# EAGLE design RH019.1 (EAGLE 7.1.0)
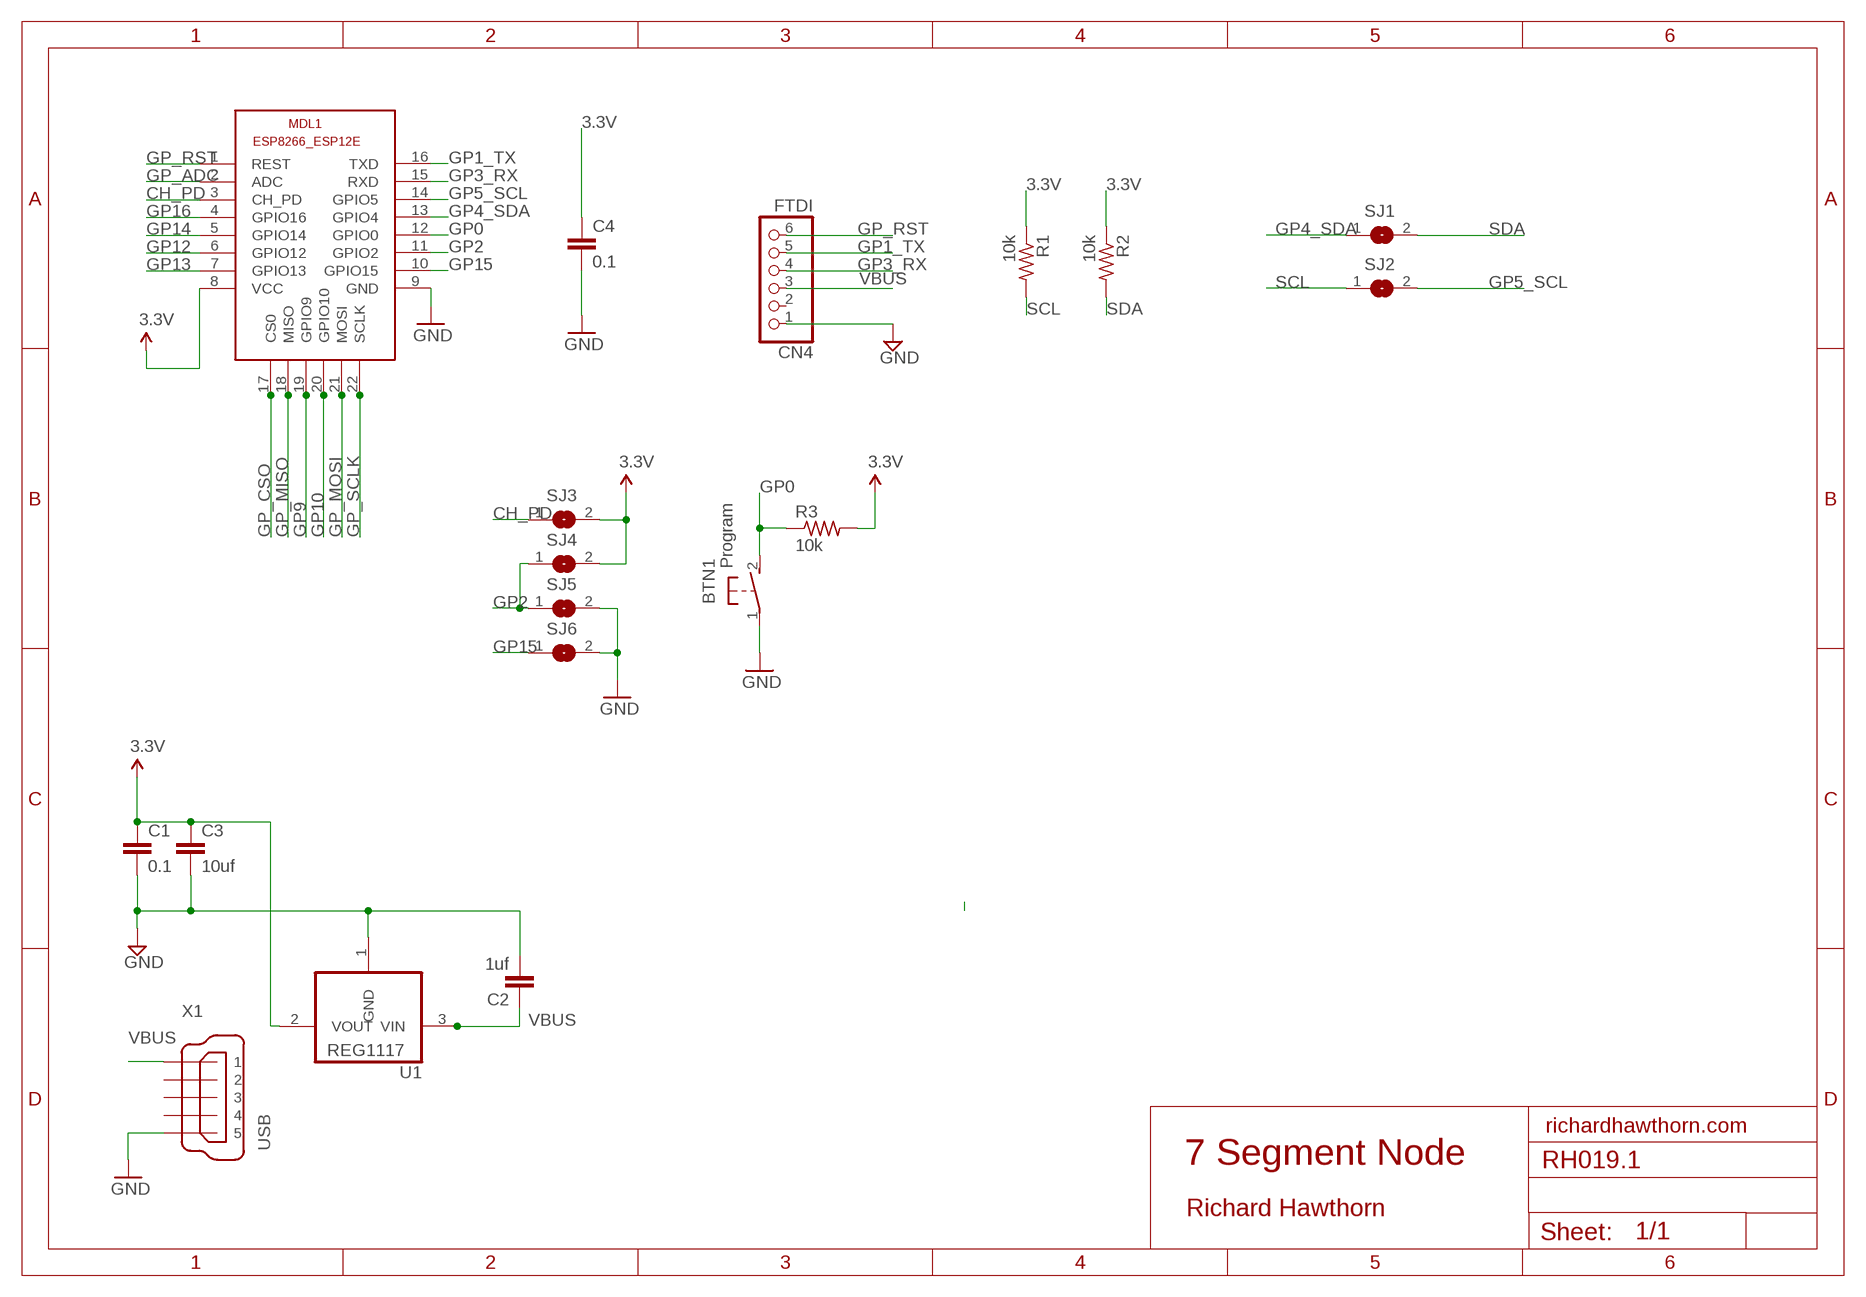
[diagram p0: schematic, sheet 1, part 1 of 2]
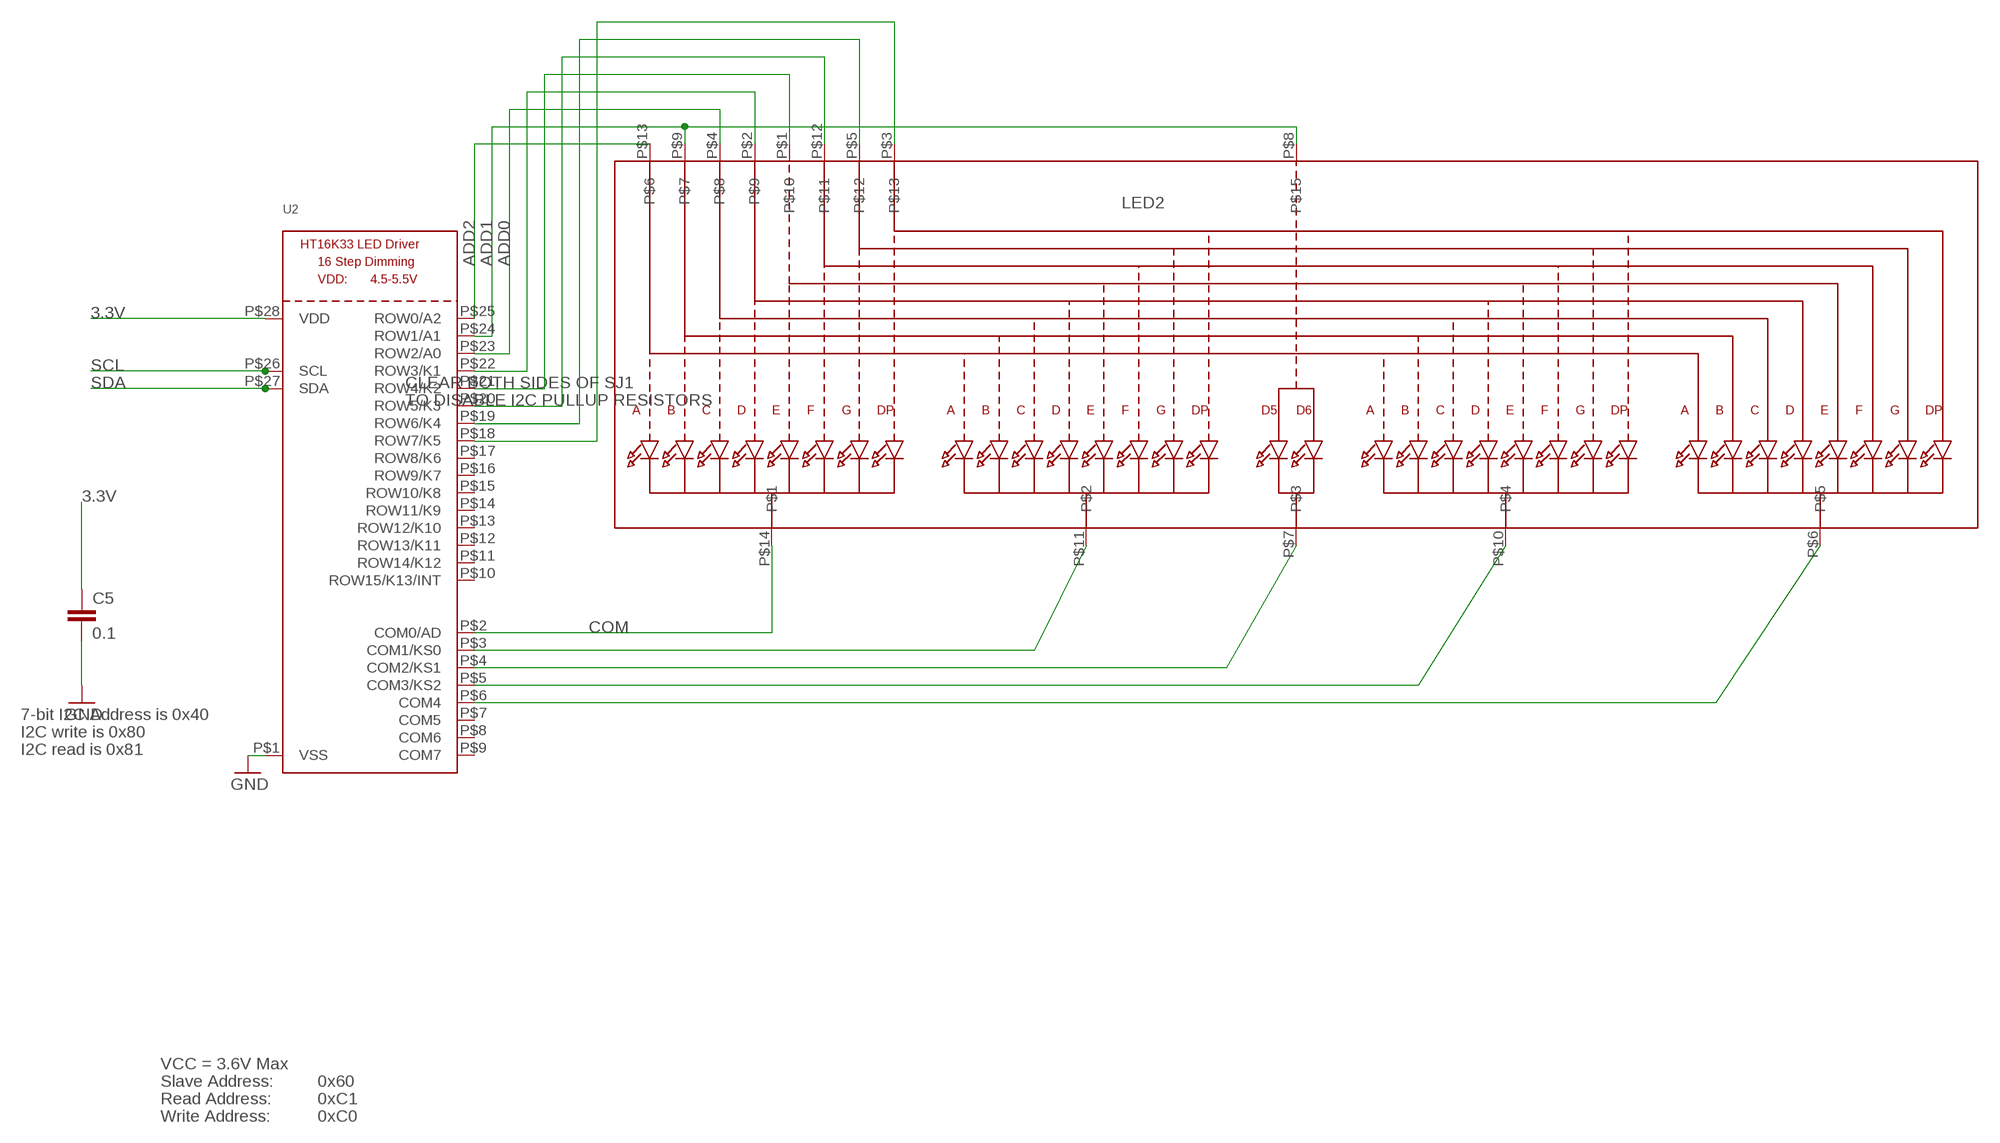
[diagram p1: schematic, sheet 1, part 2 of 2]

## Parts
BTN1  Program  DTS-3  [DTS-3]
C1  0.1  CAPPTH2  [CAP-PTH-SMALL2]
C2  1uf  CAPPTH2  [CAP-PTH-SMALL2]
C3  10uf  CAPPTH2  [CAP-PTH-SMALL2]
C4  0.1  CAPPTH2  [CAP-PTH-SMALL2]
C5  0.1  CAPPTH2  [CAP-PTH-SMALL2]
CN4  FTDI  PINHD-1X6  [1X06]
LED2  DISP_SEGMENT_4DIGIT_BL-Q56C43  [SEGMENT-BL-Q56C43]
MDL1  ESP8266-12EESP8266-ESP12E  [ESP8266-ESP12E]
R1  10k  R-US_0204/7  [0204/7]
R2  10k  R-US_0204/7  [0204/7]
R3  10k  R-US_0204/7  [0204/7]
SJ1  SJ  [SJ]
SJ2  SJ  [SJ]
SJ3  SJ  [SJ]
SJ4  SJ  [SJ]
SJ5  SJ  [SJ]
SJ6  SJ  [SJ]
U1  REG1117  [SOT223]
U2  HT16K33_SOP28  [SOP28_300MIL]
X1  USB  MINI-USB_SHIELD5P2-32005-601  [32005-601]

## Nets
3.3V: C1.1 C3.1 C4.1 C5.1 MDL1.8(VCC) R1.1 R2.1 R3.2 SJ3.2 SJ4.2 U1.2(VOUT) U2.P$28(VDD)
ADD0: LED2.P$4 U2.P$23(ROW2/A0)
ADD1: LED2.P$8 LED2.P$9 U2.P$24(ROW1/A1)
ADD2: LED2.P$13 U2.P$25(ROW0/A2)
CH_PD: MDL1.3(CH_PD) SJ3.1
COM: LED2.P$14 U2.P$2(COM0/AD)
GND [power]: BTN1.1 C1.2 C2.2 C3.2 C4.2 C5.2 CN4.1 MDL1.9(GND) SJ5.2 SJ6.2 U1.1(GND) U2.P$1(VSS) X1.5
GP0: BTN1.2 MDL1.12(GPIO0) R3.1
GP1_TX: CN4.5 MDL1.16(TXD)
GP2: MDL1.11(GPIO2) SJ4.1 SJ5.1
GP3_RX: CN4.4 MDL1.15(RXD)
GP4_SDA: MDL1.13(GPIO4) SJ1.1
GP5_SCL: MDL1.14(GPIO5) SJ2.2
GP9: MDL1.19(GPIO9)
GP10: MDL1.20(GPIO10)
GP12: MDL1.6(GPIO12)
GP13: MDL1.7(GPIO13)
GP14: MDL1.5(GPIO14)
GP15: MDL1.10(GPIO15) SJ6.1
GP16: MDL1.4(GPIO16)
GP_ADC: MDL1.2(ADC)
GP_CSO: MDL1.17(CS0)
GP_MISO: MDL1.18(MISO)
GP_MOSI: MDL1.21(MOSI)
GP_RST: CN4.6 MDL1.1(REST)
GP_SCLK: MDL1.22(SCLK)
N$7: LED2.P$11 U2.P$3(COM1/KS0)
N$8: LED2.P$7 U2.P$4(COM2/KS1)
N$9: LED2.P$10 U2.P$5(COM3/KS2)
N$10: LED2.P$6 U2.P$6(COM4)
N$11: LED2.P$2 U2.P$22(ROW3/K1)
N$12: LED2.P$1 U2.P$21(ROW4/K2)
N$13: LED2.P$12 U2.P$20(ROW5/K3)
N$15: LED2.P$5 U2.P$19(ROW6/K4)
N$16: LED2.P$3 U2.P$18(ROW7/K5)
SCL: R1.2 SJ2.1 U2.P$26(SCL)
SDA: R2.2 SJ1.2 U2.P$27(SDA)
VBUS [power]: C2.1 CN4.3 U1.3(VIN) X1.1
Unconnected: CN4.2 U2.P$7(COM5) U2.P$8(COM6) U2.P$9(COM7) U2.P$10(ROW15/K13/INT) U2.P$11(ROW14/K12) U2.P$12(ROW13/K11) U2.P$13(ROW12/K10) U2.P$14(ROW11/K9) U2.P$15(ROW10/K8) U2.P$16(ROW9/K7) U2.P$17(ROW8/K6) X1.2 X1.3 X1.4 X1.M1(S1) X1.M2(S2)

## Notes on the sheet
- CLEAR BOTH SIDES OF SJ1
- TO DISABLE I2C PULLUP RESISTORS
- 7-bit I2C Address is 0x40
- I2C write is 0x80
- I2C read is 0x81
- richardhawthorn.com
- 7 Segment Node
- Richard Hawthorn
- VCC = 3.6V Max
- Slave Address: | 0x60
- Read Address: | 0xC1
- Write Address: | 0xC0

## Library data of the parts
BTN1 = switch-tact:DTS-3
C1-C5 = LowPowerLab:CAP: Capacitor Standard 0603 ceramic capacitor, and 0.1" leaded capacitor.
CN4 = pinhead:PINHD-1X6: PIN HEADER
LED2 = microbuilder:DISP_SEGMENT_4DIGIT_BL-Q56C43
MDL1 = ESP8266-ESP12E:ESP8266-12E: ESP8266-12E with additional I/O and GPIO04/05 corrected The author cannot warrant that this library is free from error or will meet your specific requirements. Created by PuceBaboon.com. Komagane, Nagano, JAPAN
R1-R3 = adafruit:R-US_: RESISTOR, American symbol
SJ1-SJ6 = jumper:SJ: SMD solder JUMPER
U1 = burr-brown:REG1117: 800mA and 1A Low Dropout (LDO) Positive Regulator 1.8V, 2.5V, 2.85V, 3.3V, 5V, and Adj; MPN: REG1117; OC_FARNELL: 1097566; OC_NEWARK: 14P6981
U2 = microbuilder:HT16K33_SOP28
X1 = con-cypressindustries:MINI-USB_SHIELD5P2-: MINI USB-B R/A DIP 5pol. Source: www.cypressindustries.com; OC_FARNELL: unknown; OC_NEWARK: unknown

## Net classes
1 power: width 0.381 mm, clearance 0.254 mm

## Board
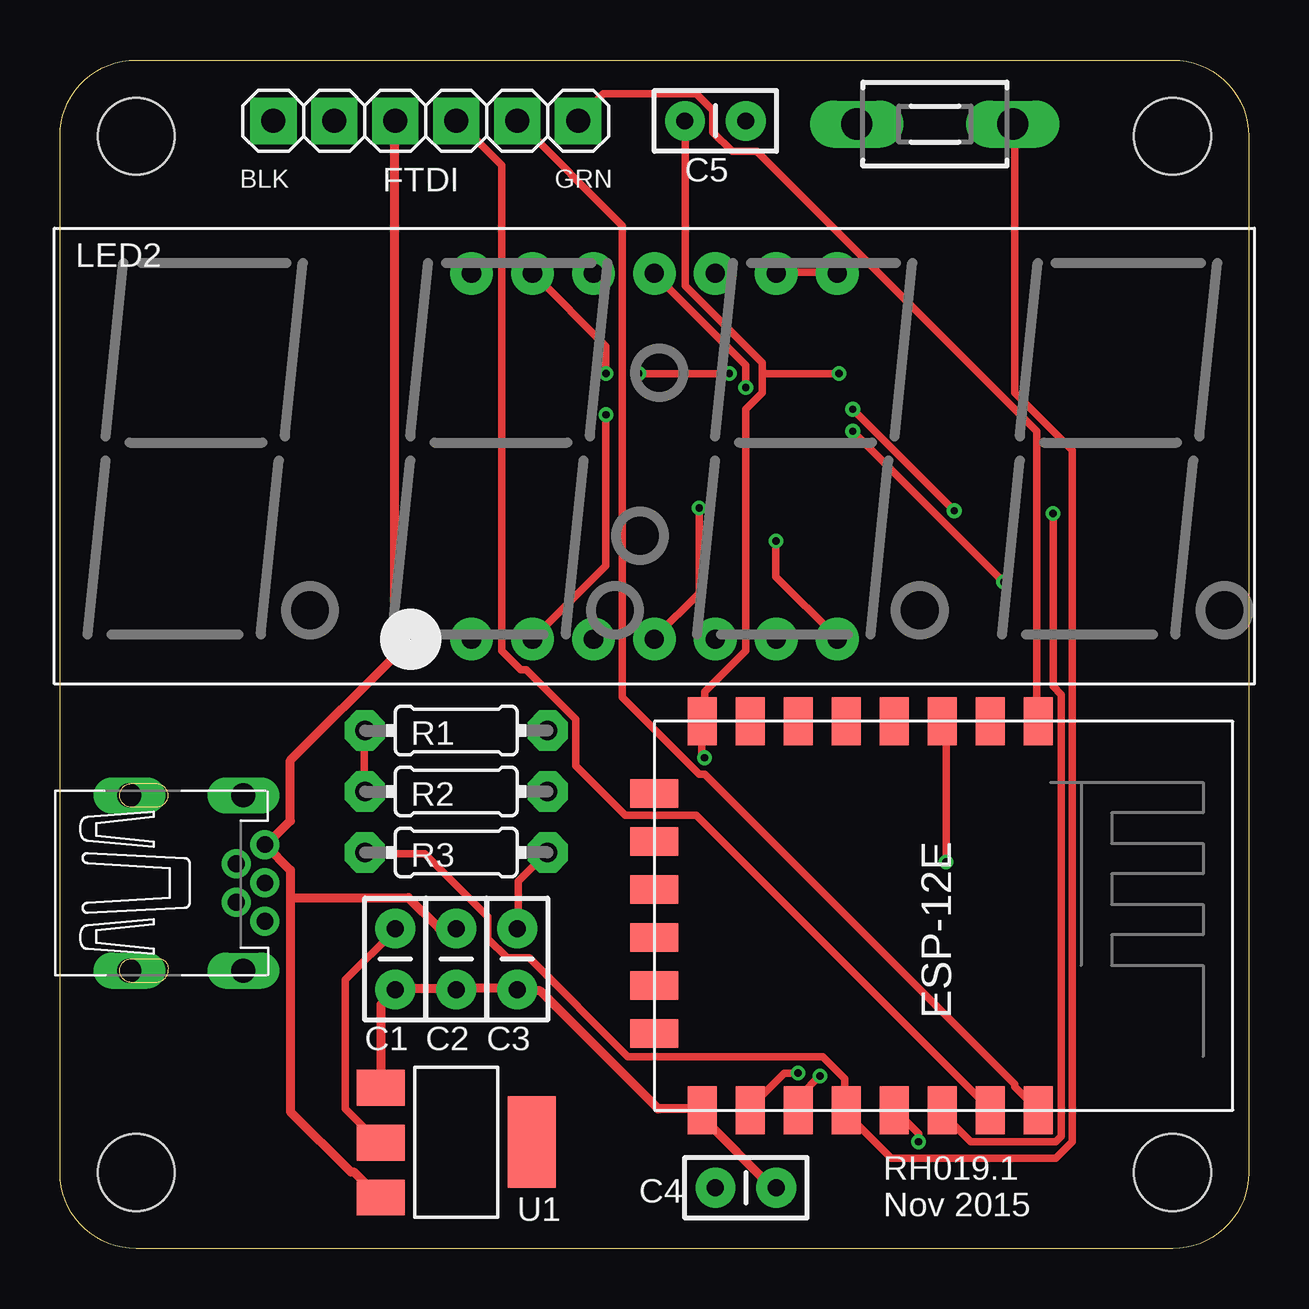
[diagram p2: board, top side]
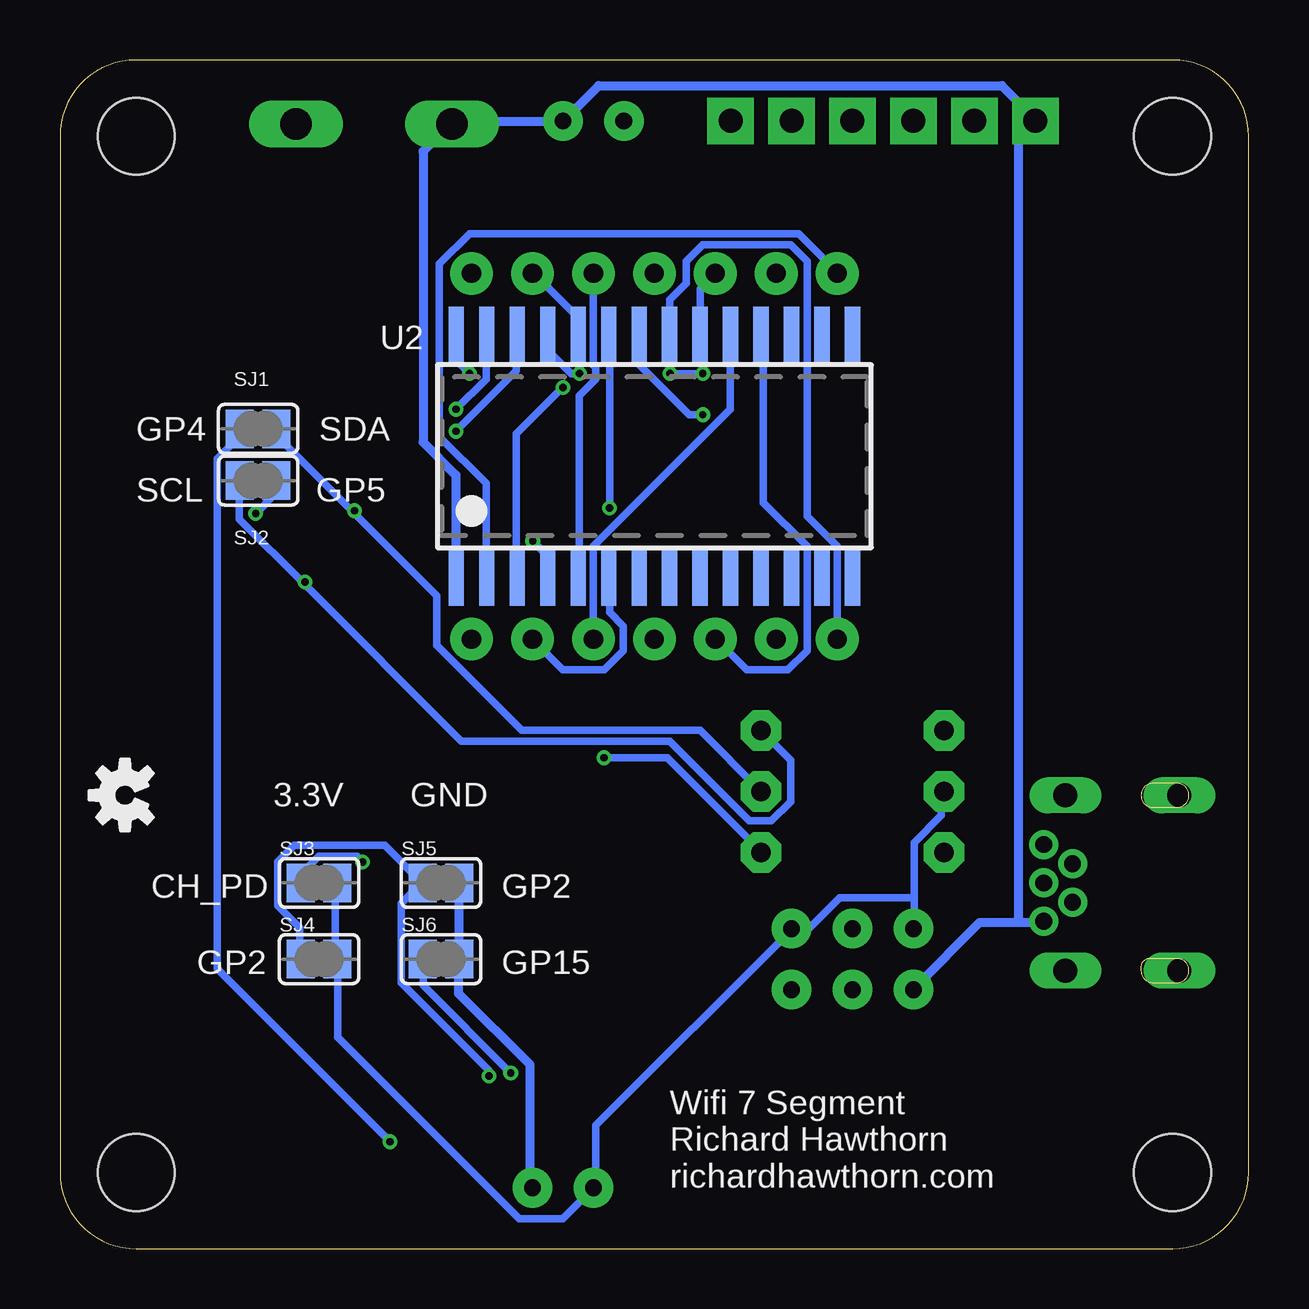
[diagram p3: board, bottom side, seen from below]

Size 49.53 x 49.53 mm. Coordinates in mm from the lower left corner, seen from the top.
Outline: 0,3.17 0,46.35 arc-90 3.17,49.53 46.35,49.53 arc-90 49.53,46.35 49.53,3.17 arc-90 46.35,0 3.17,0 arc-90 0,3.17
Copper layers (1*16): Top 0.035mm / dielectric 1.5mm / Bottom 0.035mm
Design rules "ITEADstudio_DRC *": minimum track width 12mil, minimum drill 12mil, track to track 6mil, track to pad 6mil, pad to pad 6mil, via to via 6mil, smd to smd 0mil, copper to edge 10mil, drill to drill 10mil, minimum pad ring 10mil, minimum via ring 6mil, stop-mask expansion 2mil, vias tented up to drill 100mil, thermal gap 15mil
Holes 3.2 mm at 3.17,3.17 46.35,3.17 3.17,46.35 46.35,46.35
tKeepout: area 0,0 to 5.7,5.7; area 43.8,0 to 49.5,5.7; area 43.8,43.8 to 49.5,49.5; area 0,43.8 to 5.7,49.5
bKeepout: area 0,43.8 to 5.7,49.5; area 43.8,43.8 to 49.5,49.5; area 43.8,0 to 49.5,5.7; area 0,0 to 5.7,5.7
tRestrict: area 24.3,8.9 to 29.1,12.8; area 5.8,16.9 to 6.9,18.5; area 5.2,9.7 to 6.7,10.4
bRestrict: area 27.4,17.7 to 29.2,18.7; area 21.1,13.8 to 22.9,14.9; area 21.6,12.6 to 22.1,13.2; area 20.7,12.6 to 21.2,13.2; area 20.2,12.8 to 20.7,13.5; area 20.1,13.4 to 20.6,14; area 26.5,18.9 to 27.1,19.5; area 26.5,17.9 to 27.1,18.5; area 27.5,19.1 to 28,19.8; area 27.9,18.8 to 29.1,19.6

### Footprints (pad centres in the part's own frame; a part is rotated, then mirrored left to right if it is on the bottom)
DTS-3 = drill 1.3 long: 1 -3.25,0; 2 3.25,0
CAP-PTH-SMALL2 = drill 0.7 pad 1.651: 1 0,0; 2 2.54,0
1X06 = drill 1 pad 1.93 square: 1 -6.35,0; 2 -3.81,0; 3 -1.27,0; 4 1.27,0; 5 3.81,0; 6 6.35,0
SEGMENT-BL-Q56C43 = drill 0.8 pad 1.778: P$1 -7.62,-7.62; P$2 -5.08,-7.62; P$3 -2.54,-7.62; P$4 0,-7.62; P$5 2.54,-7.62; P$6 5.08,-7.62; P$7 7.62,-7.62; P$8 7.62,7.62; P$9 5.08,7.62; P$10 2.54,7.62; P$11 0,7.62; P$12 -2.54,7.62; P$13 -5.08,7.62; P$14 -7.62,7.62
ESP8266-ESP12E = smd 2 x 1.2: 1 0,16; 2 0,14; 3 0,12; 4 0,10; 5 0,8; 6 0,6; 7 0,4; 8 0,2; 9 16.2,2; 10 16.2,4; 11 16.2,6; 12 16.2,8; 13 16.2,10; 14 16.2,12; 15 16.2,14; 16 16.2,16 | smd 1.2 x 2: 17 11,0; 18 3,0; 19 5,0; 20 13,0; 21 7,0; 22 9,0
0204/7 = drill 0.813 pad 1.676 octagon: 1 -3.81,0; 2 3.81,0
SJ = smd 1.168 x 1.6: 1 -0.762,0; 2 0.762,0
SOT223 = smd 1.499 x 2.007: 1 -2.261,-3.15; 2 0.025,-3.15; 3 2.311,-3.15 | smd 3.81 x 2.007: 4 0,3.15
SOP28_300MIL = smd 0.635 x 2.286: P$1 -8.255,-5.08; P$2 -6.985,-5.08; P$3 -5.715,-5.08; P$4 -4.445,-5.08; P$5 -3.175,-5.08; P$6 -1.905,-5.08; P$7 -0.635,-5.08; P$8 0.635,-5.08; P$9 1.905,-5.08; P$10 3.175,-5.08; P$11 4.445,-5.08; P$12 5.715,-5.08; P$13 6.985,-5.08; P$14 8.255,-5.08; P$15 8.255,5.08; P$16 6.985,5.08; P$17 5.715,5.08; P$18 4.445,5.08; P$19 3.175,5.08; P$20 1.905,5.08; P$21 0.635,5.08; P$22 -0.635,5.08; P$23 -1.905,5.08; P$24 -3.175,5.08; P$25 -4.445,5.08; P$26 -5.715,5.08; P$27 -6.985,5.08; P$28 -8.255,5.08
32005-601 = drill 0.7 pad 1.016: 1 2.825,1.6; 2 1.625,0.8; 3 2.825,0; 4 1.625,-0.8; 5 2.825,-1.6 | drill 1 pad 1.422 long: M1 -2.825,3.65; M2 -2.825,-3.65; M3 1.925,3.65; M4 1.925,-3.65

### Placement (x,y rotation side)
BTN1  36.45,46.86 0 top
C1  13.97,13.34 270 top
C2  16.51,13.34 270 top
C3  19.05,13.34 270 top
C4  27.3,2.54 0 top
C5  26.04,46.99 0 top
CN4  15.24,46.99 0 top
LED2  24.77,33.02 0 top
MDL1  24.77,21.97 270 top
R1  16.51,21.59 0 top
R2  16.51,19.05 0 top
R3  16.51,16.51 0 top
SJ1  41.27,34.16 0 bottom
SJ2  41.27,32 0 bottom
SJ3  38.73,15.24 0 bottom
SJ4  38.73,12.06 0 bottom
SJ5  33.66,15.24 0 bottom
SJ6  33.66,12.06 0 bottom
U1  16.51,4.45 270 top
U2  24.77,33.02 0 bottom
U$3  [OSHW-LOGO-S]  46.82,18.9 90 bottom
X1  5.71,15.24 0 top

### Tracks (layer width: path | path; a pad name or v marks a point on that pad's centre or on a via)
3.3V  (via drill 0.3)
  Top 0.305: 29.26,36.46 29.26,36.92 26.06,40.12 26.06,46.98 C5.1 | 29.26,36.46 29.26,35.66 28.57,34.98 28.57,24.92 26.86,23.2 26.86,22.06 MDL1.8 26.75,21.83 26.75,20.57 v26.86,20.46 | 29.26,36.46 v32.46,36.46 | C3.1 19.09,13.37 19.09,15.32 20.23,16.46 R3.2 | R2.1 12.69,19.09 12.69,21.49 R1.1 | U1.2 13.26,4.46 11.89,5.83 11.89,11.2 13.95,13.26 C1.1
  Bottom 0.305: v32.46,36.46 32.92,36.92 32.92,38.06 U2.P$28 | SJ3.2 38.06,15.2 38.06,12.12 SJ4.2 37.95,12 37.95,8.8 30.4,1.26 28.57,1.26 27.32,2.52 C4.1 27.2,2.63 27.2,5.14 19.09,13.26 C3.1 18.97,13.37 18.29,13.37 17.03,14.63 13.95,14.63 | 13.95,14.63 13.95,13.37 C1.1 | 13.95,14.63 13.95,16.92 12.8,18.06 12.8,18.97 R2.1 | v26.86,20.46 24.23,20.46 20.34,16.57 R3.2
ADD0  (via drill 0.3)
  Top 0.305: v26.63,30.86 26.63,27.32 24.8,25.49 LED2.P$4
  Bottom 0.305: v26.63,30.86 26.63,38.06 U2.P$23
ADD1
  Top 0.305: LED2.P$8 32.35,40.69 29.95,40.69 LED2.P$9
  Bottom 0.305: U2.P$24 28,38.18 28,38.86 29.83,40.69 LED2.P$9
ADD2  (via drill 0.3)
  Top 0.305: v24.12,36.46 v27.89,36.46 | v22.75,36.46 22.75,37.6 19.77,40.58 LED2.P$13
  Bottom 0.305: v27.89,36.46 28.23,36.46 29.15,37.38 29.15,38.06 U2.P$25 | v22.75,36.46 v24.12,36.46
CH_PD  (via drill 0.3)
  Top 0.305: v36.92,16.12 36.92,21.83 36.8,21.95 MDL1.3
  Bottom 0.305: v36.92,16.12 37.15,16.34 38.75,16.34 39.43,15.66 39.43,15.32 SJ3.1
COM
  Bottom 0.305: U2.P$2 31.77,28 31.77,31.89 33.72,33.83 33.72,41.03 32.46,42.29 18.75,42.29 17.14,40.69 LED2.P$14
GND
  Top 0.381: U1.1 13.37,6.74 13.37,10.17 13.95,10.74 C1.2 14.06,10.86 16.34,10.86 C2.2 16.57,10.86 18.97,10.86 C3.2 19.2,10.74 20,10.74 24.92,5.83 26.63,5.83 MDL1.9 26.86,5.71 26.86,5.37 29.6,2.63 29.83,2.63 C4.2
  Bottom 0.381: 9.6,13.6 11.2,13.6 13.95,10.86 C1.2 | 9.6,13.6 8.57,13.6 X1.5 | SJ5.2 32.92,15.2 32.92,12.12 SJ6.2 32.92,11.89 32.92,10.63 29.95,7.66 29.95,2.63 C4.2 | U2.P$1 33.03,28 33.03,32.23 34.4,33.6 34.4,45.72 33.26,46.86 BTN1.1 33.15,46.98 28.57,46.98 C5.2 28.46,47.09 27.09,48.46 10.29,48.46 8.91,47.09 CN4.1 9.03,46.86 9.6,46.29 9.6,13.6
GP0
  Top 0.305: R3.1 12.8,16.46 15.2,16.46 17.83,13.83 17.83,12.92 18.63,12.12 19.55,12.12 23.66,8 31.77,8 32.69,7.09 32.69,5.83 MDL1.12 32.69,5.71 34.63,3.77 41.49,3.77 42.18,4.46 42.18,33.26 39.78,35.66 39.78,46.86 BTN1.2
GP1_TX
  Top 0.305: MDL1.16 40.69,5.83 39.78,6.74 39.78,6.86 26.86,19.77 26.63,19.77 23.43,22.97 23.43,42.63 19.09,46.98 CN4.5
GP2  (via drill 0.3)
  Top 0.305: v31.66,7.2 30.86,6.4 30.86,5.83 MDL1.11
  Bottom 0.305: SJ4.1 39.55,12.12 39.55,13.37 40.46,14.29 40.46,16.12 39.78,16.8 36.01,16.8 34.52,15.32 SJ5.1 34.52,15.2 35.32,14.4 35.32,11.09 31.66,7.43 v31.66,7.2
GP3_RX
  Top 0.305: MDL1.15 38.75,5.83 26.52,18.06 23.55,18.06 21.49,20.12 21.49,22.06 19.43,24.12 19.2,24.12 18.4,24.92 18.4,45.15 16.57,46.98 CN4.4
GP4_SDA  (via drill 0.3)
  Top 0.305: v35.78,4.46 35.78,4.8 34.86,5.71 MDL1.13
  Bottom 0.305: v35.78,4.46 42.98,11.66 42.98,32.92 42.06,33.83 42.06,34.06 SJ1.1
GP5_SCL  (via drill 0.3)
  Top 0.305: v41.38,30.63 41.38,23.43 41.72,23.09 41.72,4.69 41.49,4.46 37.95,4.46 36.69,5.71 MDL1.14
  Bottom 0.305: v41.38,30.63 40.58,31.43 40.58,32 SJ2.2
GP15  (via drill 0.3)
  Top 0.305: v30.75,7.32 30.18,7.32 28.69,5.83 MDL1.10
  Bottom 0.305: v30.75,7.32 34.4,10.97 34.4,12 SJ6.1
GP_RST
  Top 0.305: MDL1.1 40.69,22.06 40.69,34.06 29.03,45.72 28,45.72 27.2,46.52 27.2,47.43 26.52,48.12 22.63,48.12 21.6,47.09 CN4.6
N$7  (via drill 0.3)
  Top 0.305: v28.57,35.89 28.57,36.8 24.8,40.58 LED2.P$11
  Bottom 0.305: v28.57,35.89 30.52,33.95 30.52,28 U2.P$3
N$8  (via drill 0.3)
  Top 0.305: v29.83,29.49 29.83,28 32.35,25.49 LED2.P$7
  Bottom 0.305: v29.83,29.49 29.26,28.92 29.26,28 U2.P$4
N$9
  Bottom 0.305: U2.P$5 27.89,28 27.89,35.55 27.2,36.23 27.2,36.69 27.32,36.8 27.32,40.58 LED2.P$10
N$10
  Bottom 0.305: U2.P$6 26.63,27.89 26.63,26.52 26.06,25.95 26.06,24.92 26.86,24.12 28.57,24.12 29.83,25.38 LED2.P$6
N$11  (via drill 0.3)
  Top 0.305: v22.75,34.75 22.75,28.46 LED2.P$2
  Bottom 0.305: v22.75,34.75 23.32,34.75 25.38,36.8 25.38,38.06 U2.P$22
N$12
  Bottom 0.305: LED2.P$1 17.14,29.26 18.4,30.52 18.4,41.15 19.09,41.83 22.75,41.83 23.43,41.15 23.43,40.23 24.12,39.55 24.12,38.18 U2.P$21
N$13
  Bottom 0.305: U2.P$20 22.86,40.01 LED2.P$12
N$15
  Bottom 0.305: U2.P$19 21.6,38.06 21.6,34.98 27.32,29.26 27.32,25.49 LED2.P$5
N$16
  Bottom 0.305: U2.P$18 20.23,38.06 20.23,31.09 18.4,29.26 18.4,24.92 19.2,24.12 20.92,24.12 22.17,25.38 LED2.P$3
SCL  (via drill 0.3)
  Top 0.305: v39.32,27.77 v33.03,34.06
  Bottom 0.305: 39.38,27.72 32.8,21.14 24.12,21.14 20.8,17.83 19.89,17.83 19.09,18.63 19.09,20.34 20.23,21.49 R1.2 | 39.38,27.72 42.06,30.4 42.06,32 SJ2.1 | v33.03,34.06 30.52,36.58 30.52,38.06 U2.P$26 | v39.32,27.77 39.38,27.72
SDA  (via drill 0.3)
  Top 0.305: v37.26,30.75 v33.03,34.98
  Bottom 0.305: 37.32,30.69 33.83,27.2 33.83,25.15 30.29,21.6 22.86,21.6 20.34,19.09 R2.2 | 37.32,30.69 40.46,33.83 40.46,34.06 SJ1.2 | v33.03,34.98 31.77,36.23 31.77,38.06 U2.P$27 | v37.26,30.75 37.32,30.69
VBUS
  Top 0.381: 9.6,14.63 9.6,15.77 8.57,16.8 X1.1 8.69,16.92 9.6,17.83 9.6,20.34 13.95,24.69 13.95,46.98 CN4.3 | 9.6,14.63 9.6,5.71 12.12,3.2 12.23,3.2 13.26,2.17 U1.3 | 9.6,14.63 14.52,14.63 15.77,13.37 16.46,13.37 C2.1

### Text on the board
tNames: FTDI | BLK | GRN | RH019.1 / Nov 2015
bNames: SDA | GP4 | GP5 | SCL | GND | 3.3V | GP2 | CH_PD | GP15 | GP2 | Wifi 7 Segment / Richard Hawthorn / richardhawthorn.com
tDocu: REG